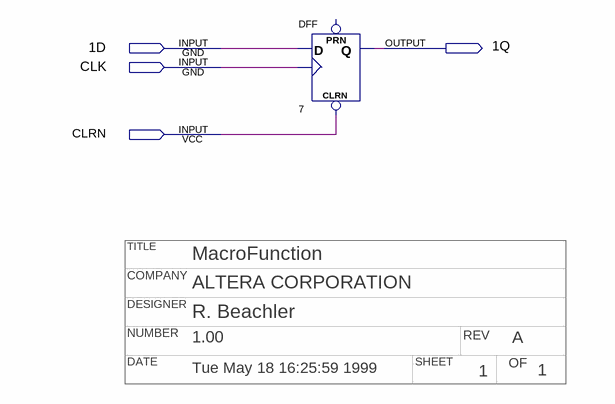
[diagram p0: schematic sheet]
// Quartus schematic 74174m.bdf as structural Verilog: 1 symbols, 4 pins
// Title block: TITLE: MacroFunction; COMPANY: ALTERA CORPORATION; DESIGNER: R. Beachler; NUMBER: 1.00; REV: A; DATE: Tue May 18 16:25:59 1999; SHEET: 1; OF: 1
module \74174m  (
  input  \1D ,
  input  CLK,
  input  CLRN,
  output \1Q 
);

  DFF u_7 (.CLRN(CLRN), .CLK(CLK), .D(\1D ), .Q(\1Q ));  // open: PRN
endmodule
